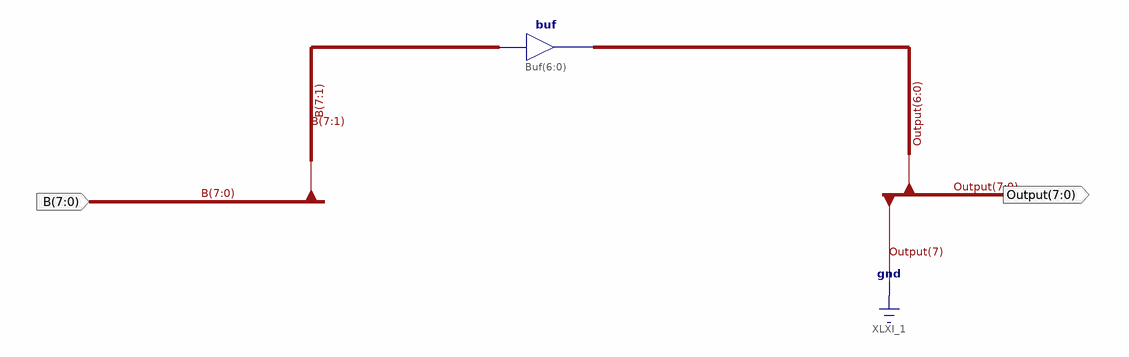
[diagram p0: schematic sheet 1]
// Xilinx ISE schematic proj1logicalshiftright.sch (spartan6) as structural Verilog: 1 symbols, 2 ports
module proj1logicalshiftright (
  input  [7:0] B,
  output [7:0] Output
);

  assign Output[6:0] = B[7:1];  // buf Buf[6..0], 7 bits wide

  assign Output[7] = 1'b0;
endmodule
